# Altium schematic sheet lab4_analog_input.SchDoc
size A4; Author: Michał Wojna; CompanyName: AGH; Revision: 1; SheetNumber: 2; SheetTotal: 3
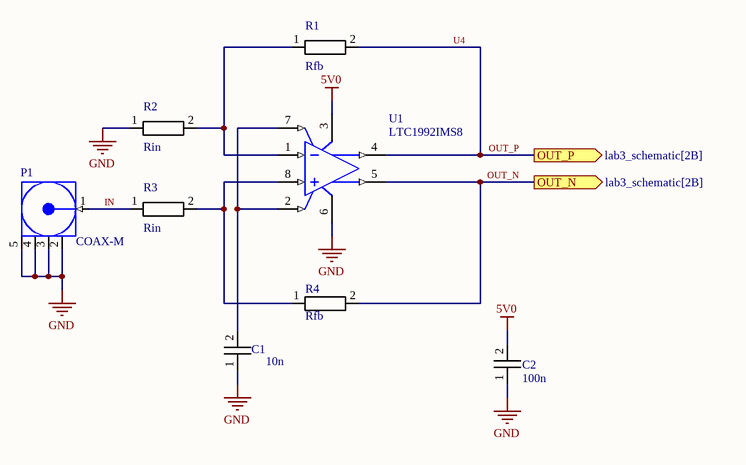
[diagram p0: lab4_analog_input.SchDoc]

## Parts
C1  10n  [0805_STD]
C2  100n  [0805_STD]
P1  COAX-M  [MMCX2.54-V5]
R1  Rfb  [0603]
R2  Rin  [0603]
R3  Rin  [0603]
R4  Rfb  [0603]
U1  LTC1992IMS8  [LT-MS8-8_L]

## Ports
OUT_N (out, see lab3_schematic[2B]), OUT_P (out, see lab3_schematic[2B])

## Nets
5V0: C2.2(PIN) U1.3(+VS)
GND: C1.1(PIN) C2.1(PIN) P1.2(GND) P1.3(GND) P1.4(GND) P1.5(GND) R2.1(PIN) U1.6(-VS)
IN: P1.1(Signal) R3.1(PIN)
OUT_N: R4.2(PIN) U1.5(-OUT) ; port OUT_N
OUT_P: R1.2(PIN) U1.4(+OUT) ; port OUT_P  [also labelled U4]
NetC1_2: C1.2(PIN) U1.2(VOCM) U1.7(VMID)
NetR1_1: R1.1(PIN) R2.2(PIN) U1.1(-IN)
NetR3_2: R3.2(PIN) R4.1(PIN) U1.8(+IN)

## Notes on the sheet
- Company Confidenrial / Not for distribution!
- Project name:
- Document Name:
- Designer Name:
- Date / Time:
- Revision:

## Library data of the parts
C1 C2 = Capacitor: Manufacturer: *; Part Number: *
  C1: Value: 10n
  C2: Value: 100n
P1 = COAX-M: RF Coaxial PCB Connector, MMCX; Thru-Hole, Vertical Mount Plug,  50 Ohm Impedance; PackageDocument: Rev. A, 16-Jun-1997; PCB_Layout: Complies with manufacturer's recommendation.; DrillSize: Corresponds to nominal value.; Published: 15-Jul-2004; LatestRevisionDate: 15-Jul-2004; LatestRevisionNote: Component Replaced.; DatasheetDocument: 30-May-2003; PackageReference: 908-21103; Publisher: Altium Limited; ComponentLink1Description: Manufacturer Link; ComponentLink1URL: http://www.amphenolrf.com/
R1-R4 = Resistor: Manufacturer: *; Part Number: *
  R1 R4: Value: Rfb
  R2 R3: Value: Rin
U1 = CMP-0359-00506-2: Single Channel, Low Power, Fully Differential Input / Output Amplifier / Driver, 4 MHz Typical GBW, 0.75 V/us Typical SR, 2.4 to 12 V, 8-Pin SOP (MS8-8), Industrial; Manufacturer: Linear Technology; Is (mA) Typical: 0.65; Vs Min (V): 2.4; SR (V/us) Typical: 0.75; Vos (mV) Typical: 0.25; Vs Max (V): 12; Channels (#): 1; GBW (MHz) Typical: 4; ComponentLink3URL: http://cds.linear.com/docs/en/packaging/05081610_G_SO8.pdf; Linear Technology Part Number: LTC1992; PackageDescription: 8-Lead Plastic Small Outline, Body 3.9 x 4.9 mm, Pitch 1.27 mm; Type: DIFF; ComponentLink1URL: http://www.linear.com/; ComponentLink2Description: Datasheet; PartNumber: LTC1992IMS8; DatasheetVersion: Rev. A; ComponentLink3Description: Package Specification; Mounting Technology: Surface Mount; ComponentLink2URL: http://cds.linear.com/docs/en/datasheet/1992fb.pdf; RevisionNote: URLs updated; PackageReference: LT-MS8-8; ComponentLink1Description: Manufacturer URL; PackageVersion: Rev G